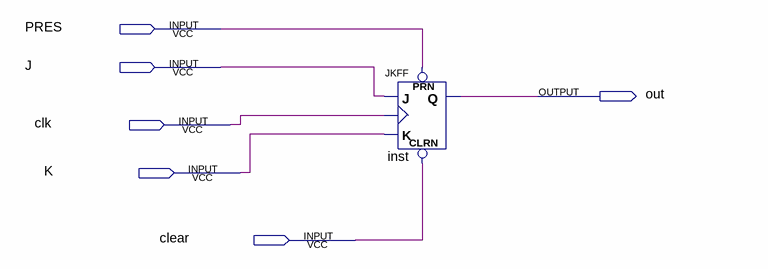
[diagram p0: schematic sheet]
// Quartus schematic PROVA.bdf as structural Verilog: 1 symbols, 6 pins
module PROVA (
  input  PRES,
  input  J,
  input  clk,
  input  K,
  input  clear,
  output out
);

  JKFF inst (.PRN(PRES), .CLRN(clear), .K(K), .J(J), .CLK(clk), .Q(out));
endmodule
